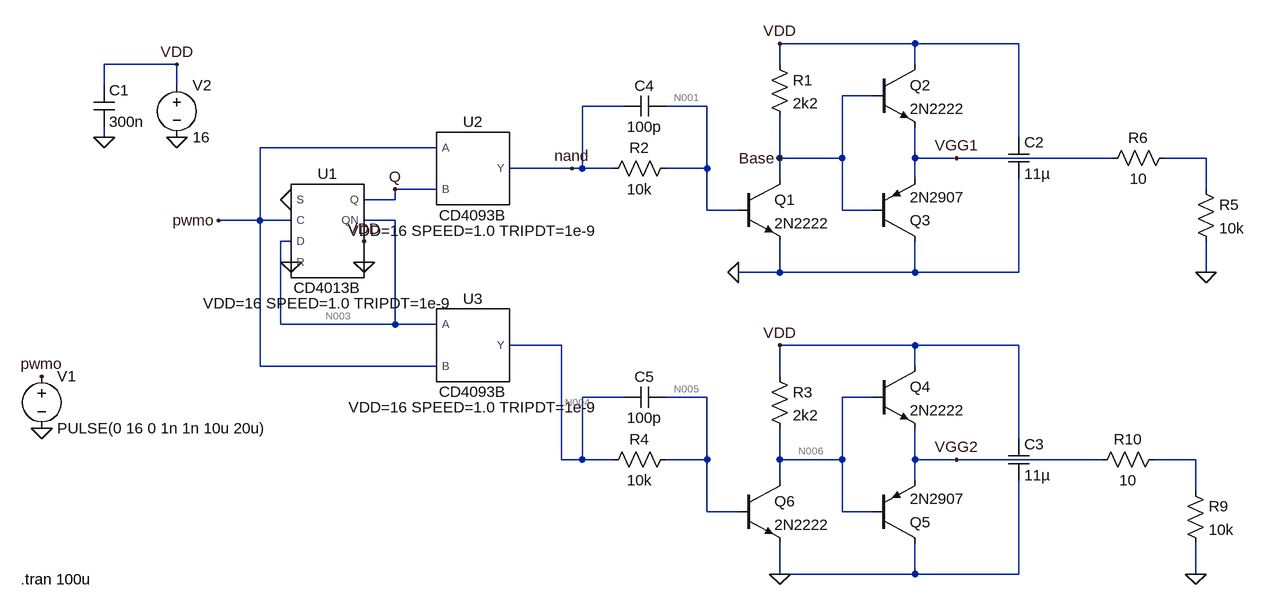
[diagram p0: schematic sch.asc]
sch.asc, the LTspice schematic file:
Version 4
SHEET 1 1296 680
WIRE 784 -224 576 -224
WIRE 944 -224 784 -224
WIRE -352 -192 -464 -192
WIRE 576 -192 576 -224
WIRE 784 -192 784 -224
WIRE -464 -160 -464 -192
WIRE -352 -160 -352 -192
WIRE 720 -144 672 -144
WIRE 336 -128 272 -128
WIRE 464 -128 400 -128
WIRE -464 -80 -464 -96
WIRE 944 -80 944 -224
WIRE 48 -64 -224 -64
WIRE 576 -48 576 -112
WIRE 672 -48 672 -144
WIRE 672 -48 576 -48
WIRE 784 -48 784 -96
WIRE 848 -48 784 -48
WIRE 1088 -48 848 -48
WIRE 1232 -48 1168 -48
WIRE 256 -32 160 -32
WIRE 272 -32 272 -128
WIRE 272 -32 256 -32
WIRE 320 -32 272 -32
WIRE 464 -32 464 -128
WIRE 464 -32 400 -32
WIRE 576 -16 576 -48
WIRE 784 -16 784 -48
WIRE 48 0 -16 0
WIRE 1232 0 1232 -48
WIRE -16 16 -16 0
WIRE -16 16 -64 16
WIRE 464 32 464 -32
WIRE 512 32 464 32
WIRE 672 32 672 -48
WIRE 720 32 672 32
WIRE -224 48 -224 -64
WIRE -224 48 -288 48
WIRE -176 48 -224 48
WIRE -16 48 -64 48
WIRE -176 80 -192 80
WIRE 576 128 576 80
WIRE 576 128 512 128
WIRE 784 128 784 80
WIRE 784 128 576 128
WIRE 944 128 944 -16
WIRE 944 128 784 128
WIRE 1232 128 1232 80
WIRE -192 208 -192 80
WIRE -16 208 -16 48
WIRE -16 208 -192 208
WIRE 48 208 -16 208
WIRE 240 240 160 240
WIRE 784 240 576 240
WIRE 944 240 784 240
WIRE -224 272 -224 48
WIRE 48 272 -224 272
WIRE 784 272 784 240
WIRE 576 288 576 240
WIRE 336 320 272 320
WIRE 464 320 400 320
WIRE 720 320 672 320
WIRE 944 384 944 240
WIRE 240 416 240 240
WIRE 272 416 272 320
WIRE 272 416 240 416
WIRE 320 416 272 416
WIRE 464 416 464 320
WIRE 464 416 400 416
WIRE 576 416 576 368
WIRE 672 416 672 320
WIRE 672 416 576 416
WIRE 784 416 784 368
WIRE 848 416 784 416
WIRE 1072 416 848 416
WIRE 1216 416 1152 416
WIRE 576 448 576 416
WIRE 784 448 784 416
WIRE 1216 464 1216 416
WIRE 464 496 464 416
WIRE 512 496 464 496
WIRE 672 496 672 416
WIRE 720 496 672 496
WIRE 576 592 576 544
WIRE 784 592 784 544
WIRE 784 592 576 592
WIRE 944 592 944 448
WIRE 944 592 784 592
WIRE 1216 592 1216 544
FLAG -288 48 pwmo
FLAG 576 -224 VDD
FLAG 848 -48 VGG1
FLAG 512 128 0
FLAG -560 288 pwmo
FLAG -560 368 0
FLAG -352 -80 0
FLAG -352 -192 VDD
FLAG -64 80 VDD
FLAG -64 112 0
FLAG -176 112 0
FLAG -176 16 0
FLAG -464 -80 0
FLAG 256 -32 nand
FLAG 576 240 VDD
FLAG 848 416 VGG2
FLAG 576 592 0
FLAG -16 0 Q
FLAG 1216 592 0
FLAG 1232 128 0
FLAG 576 -48 Base
SYMBOL npn 720 -192 R0
SYMATTR InstName Q2
SYMATTR Value 2N2222
SYMBOL pnp 720 80 M180
SYMATTR InstName Q3
SYMATTR Value 2N2907
SYMBOL res 560 -208 R0
SYMATTR InstName R1
SYMATTR Value 2k2
SYMBOL res 416 -48 R90
WINDOW 0 0 56 VBottom 2
WINDOW 3 32 56 VTop 2
SYMATTR InstName R2
SYMATTR Value 10k
SYMBOL res 416 400 R90
WINDOW 0 0 56 VBottom 2
WINDOW 3 32 56 VTop 2
SYMATTR InstName R4
SYMATTR Value 10k
SYMBOL voltage -560 272 R0
WINDOW 123 0 0 Left 0
WINDOW 39 0 0 Left 0
SYMATTR InstName V1
SYMATTR Value PULSE(0 16 0 1n 1n 10u 20u)
SYMBOL voltage -352 -176 R0
WINDOW 123 0 0 Left 0
WINDOW 39 0 0 Left 0
SYMATTR InstName V2
SYMATTR Value 16
SYMBOL CD4013B -128 64 R0
SYMATTR InstName U1
SYMATTR SpiceLine VDD=16 SPEED=1.0 TRIPDT=1e-9
SYMBOL CD4093B 96 -32 R0
SYMATTR InstName U2
SYMATTR SpiceLine VDD=16 SPEED=1.0 TRIPDT=1e-9
SYMBOL CD4093B 96 240 R0
SYMATTR InstName U3
SYMATTR SpiceLine VDD=16 SPEED=1.0 TRIPDT=1e-9
SYMBOL cap -480 -160 R0
SYMATTR InstName C1
SYMATTR Value 300n
SYMBOL cap 928 -80 R0
SYMATTR InstName C2
SYMATTR Value 11µ
SYMBOL npn 720 272 R0
SYMATTR InstName Q4
SYMATTR Value 2N2222
SYMBOL pnp 720 544 M180
SYMATTR InstName Q5
SYMATTR Value 2N2907
SYMBOL res 560 272 R0
SYMATTR InstName R3
SYMATTR Value 2k2
SYMBOL cap 928 384 R0
SYMATTR InstName C3
SYMATTR Value 11µ
SYMBOL npn 512 -16 R0
SYMATTR InstName Q1
SYMATTR Value 2N2222
SYMBOL npn 512 448 R0
SYMATTR InstName Q6
SYMATTR Value 2N2222
SYMBOL res 1216 -16 R0
SYMATTR InstName R5
SYMATTR Value 10k
SYMBOL res 1184 -64 R90
WINDOW 0 0 56 VBottom 2
WINDOW 3 32 56 VTop 2
SYMATTR InstName R6
SYMATTR Value 10
SYMBOL res 1200 448 R0
SYMATTR InstName R9
SYMATTR Value 10k
SYMBOL res 1168 400 R90
WINDOW 0 0 56 VBottom 2
WINDOW 3 32 56 VTop 2
SYMATTR InstName R10
SYMATTR Value 10
SYMBOL cap 400 -144 R90
WINDOW 0 0 32 VBottom 2
WINDOW 3 32 32 VTop 2
SYMATTR InstName C4
SYMATTR Value 100p
SYMBOL cap 400 304 R90
WINDOW 0 0 32 VBottom 2
WINDOW 3 32 32 VTop 2
SYMATTR InstName C5
SYMATTR Value 100p
TEXT -592 600 Left 2 !.tran 100u

The netlist it stands for:
* sch.asc
Q2 VDD Base VGG1 0 2N2222
Q3 0 Base VGG1 0 2N2907
R1 VDD Base 2k2
R2 N001 nand 10k
R4 N005 N004 10k
V1 pwmo 0 PULSE(0 16 0 1n 1n 10u 20u)
V2 VDD 0 16
XU1 0 pwmo N003 0 Q N003 VDD 0 CD4013B VDD=16 SPEED=1.0 TRIPDT=1e-9  ; pins S C D R Q QN
XU2 pwmo Q nand VDD 0 CD4093B VDD=16 SPEED=1.0 TRIPDT=1e-9  ; pins A B Y
XU3 N003 pwmo N004 VDD 0 CD4093B VDD=16 SPEED=1.0 TRIPDT=1e-9  ; pins A B Y
C1 VDD 0 300n
C2 VDD 0 11µ
Q4 VDD N006 VGG2 0 2N2222
Q5 0 N006 VGG2 0 2N2907
R3 VDD N006 2k2
C3 VDD 0 11µ
Q1 Base N001 0 0 2N2222
Q6 N006 N005 0 0 2N2222
R5 N002 0 10k
R6 N002 VGG1 10
R9 N007 0 10k
R10 N007 VGG2 10
C4 N001 nand 100p
C5 N005 N004 100p
.model NPN NPN
.model PNP PNP
.lib standard.bjt
.tran 100u
.lib CD4000_v.lib
.backanno
.end

* Results of the author's LTspice run, read from the files saved beside the schematic
* Operating Point, zero values left out:
*   V(vdd) = 16 V
*   V(base) = 33.36 mV
*   V(n001) = 739.1 mV
*   V(nand) = 15.77 V
*   V(n005) = 739.1 mV
*   V(n004) = 15.77 V
*   V(n003) = 16 V
*   V(n006) = 33.36 mV
*   Ic(Q2) = 16.01 pA
*   Ib(Q2) = -15.94 pA
*   Ic(Q4) = 16.01 pA
*   Ib(Q4) = -15.94 pA
*   Ic(Q1) = 7.258 mA
*   Ib(Q1) = 1.503 mA
*   Ie(Q1) = -8.76 mA
*   Ic(Q6) = 7.258 mA
*   Ib(Q6) = 1.503 mA
*   Ie(Q6) = -8.76 mA
*   I(R1) = 7.258 mA
*   I(R2) = -1.503 mA
*   I(R4) = -1.503 mA
*   I(R3) = 7.258 mA
*   I(V2) = -14.52 mA
*   Ix(u1:D) = 160 nA
*   Ix(u1:QN) = -320 nA
*   Ix(u1:VGND) = 160 nA
*   Ix(u2:Y) = -1.503 mA
*   Ix(u2:VGND) = 1.503 mA
*   Ix(u3:A) = 160 nA
*   Ix(u3:Y) = -1.503 mA
*   Ix(u3:VGND) = 1.502 mA
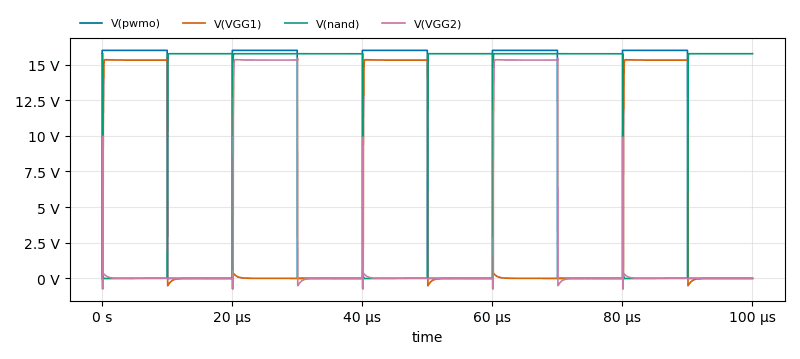
[diagram p1: Transient Analysis of sch.asc, plotted from the saved traces]
* Transient Analysis, 1 run:
*   V(pwmo): min 0 V, max 16 V, average 8.001 V, rms 11.31 V, last 0 V
*   V(VGG1): min -732.1 mV, max 15.43 V, average 4.536 V, rms 8.332 V, last 0 V
*   V(nand): min -15.09 mV, max 15.77 V, average 11.04 V, rms 13.19 V, last 15.77 V
*   V(VGG2): min -732.1 mV, max 15.43 V, average 3.03 V, rms 6.805 V, last 0 V